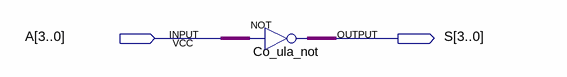
[diagram p0: schematic sheet]
// Quartus schematic not_4co.bdf as structural Verilog: 1 symbols, 2 pins
module not_4co (
  input  [3:0] A,
  output [3:0] S
);

  assign S = ~A;  // NOT Co_ula_not, 4 bits wide
endmodule
